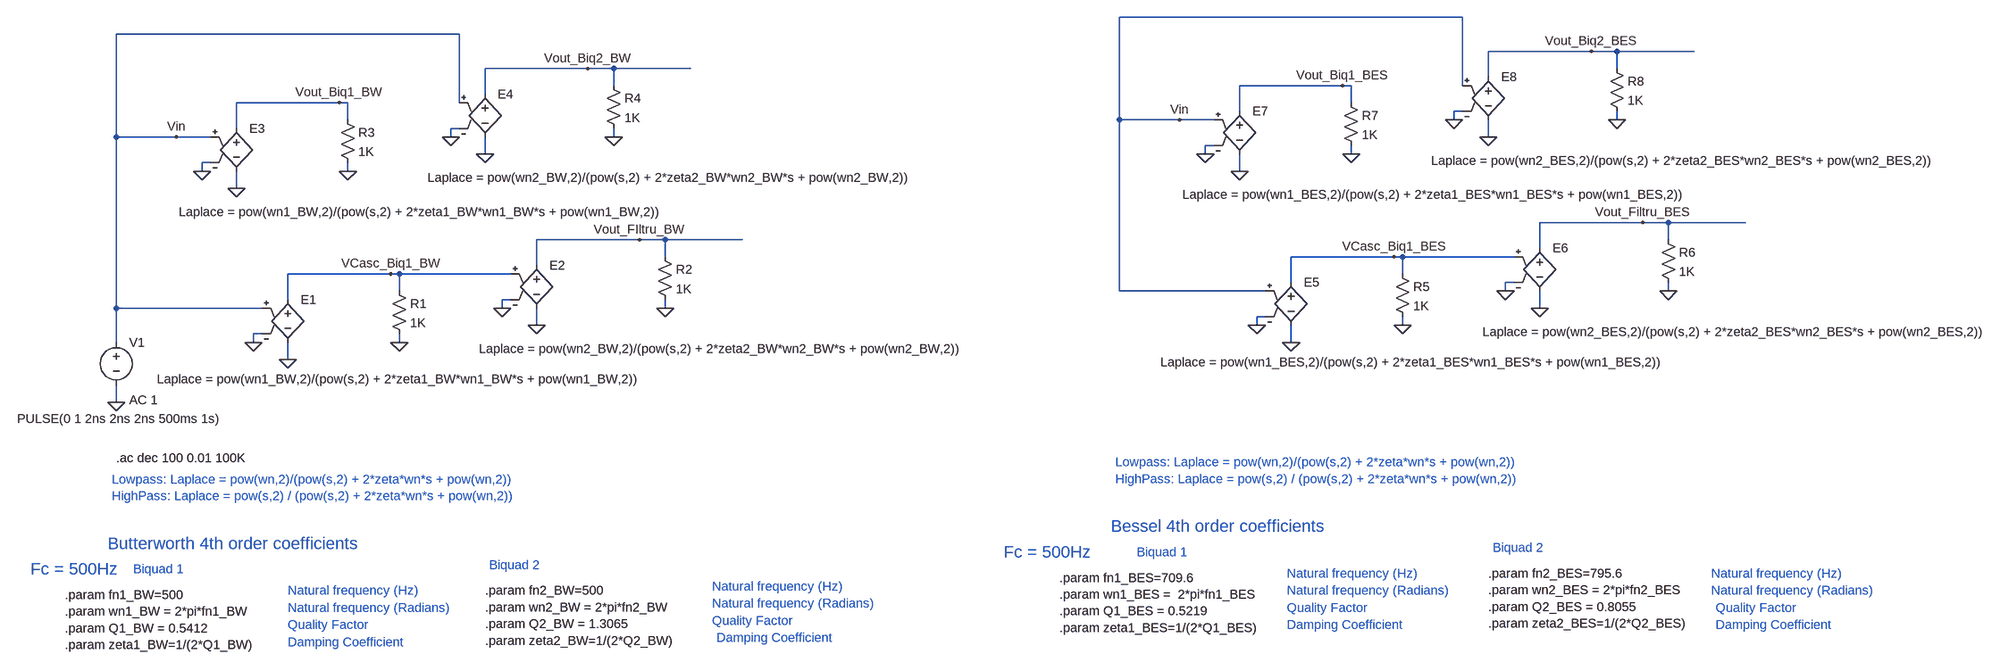
[diagram p0: schematic Laplace_Biquad_TJ_Comp_Bessel_025_Ariana.asc]
Laplace_Biquad_TJ_Comp_Bessel_025_Ariana.asc, the LTspice schematic file:
Version 4.1
SHEET 1 3528 812
WIRE 2464 -496 1824 -496
WIRE 592 -464 -48 -464
WIRE 2704 -432 2512 -432
WIRE 2752 -432 2704 -432
WIRE 2896 -432 2752 -432
WIRE 832 -400 640 -400
WIRE 880 -400 832 -400
WIRE 1024 -400 880 -400
WIRE 2752 -400 2752 -432
WIRE 2512 -384 2512 -432
WIRE 880 -368 880 -400
WIRE 2240 -368 2048 -368
WIRE 2256 -368 2240 -368
WIRE 2464 -368 2464 -496
WIRE 640 -352 640 -400
WIRE 368 -336 176 -336
WIRE 384 -336 368 -336
WIRE 592 -336 592 -464
WIRE 2256 -336 2256 -368
WIRE 2048 -320 2048 -368
WIRE 2464 -320 2448 -320
WIRE 384 -304 384 -336
WIRE 1824 -304 1824 -496
WIRE 1936 -304 1824 -304
WIRE 2000 -304 1936 -304
WIRE 2448 -304 2448 -320
WIRE 2752 -304 2752 -320
WIRE 176 -288 176 -336
WIRE 592 -288 576 -288
WIRE -48 -272 -48 -464
WIRE 64 -272 -48 -272
WIRE 128 -272 64 -272
WIRE 576 -272 576 -288
WIRE 880 -272 880 -288
WIRE 2512 -272 2512 -304
WIRE 2000 -256 1984 -256
WIRE 640 -240 640 -272
WIRE 1984 -240 1984 -256
WIRE 2256 -240 2256 -256
WIRE 128 -224 112 -224
WIRE 112 -208 112 -224
WIRE 384 -208 384 -224
WIRE 2048 -208 2048 -240
WIRE 176 -176 176 -208
WIRE 2800 -112 2608 -112
WIRE 2848 -112 2800 -112
WIRE 2992 -112 2848 -112
WIRE 928 -80 736 -80
WIRE 976 -80 928 -80
WIRE 1120 -80 976 -80
WIRE 2848 -80 2848 -112
WIRE 2608 -64 2608 -112
WIRE 976 -48 976 -80
WIRE 2336 -48 2144 -48
WIRE 2352 -48 2336 -48
WIRE 2560 -48 2352 -48
WIRE 736 -32 736 -80
WIRE 464 -16 272 -16
WIRE 480 -16 464 -16
WIRE 688 -16 480 -16
WIRE 2352 -16 2352 -48
WIRE 2144 0 2144 -48
WIRE 2560 0 2544 0
WIRE 480 16 480 -16
WIRE 1824 16 1824 -304
WIRE 2096 16 1824 16
WIRE 2544 16 2544 0
WIRE 2848 16 2848 0
WIRE 272 32 272 -16
WIRE 688 32 672 32
WIRE -48 48 -48 -272
WIRE 224 48 -48 48
WIRE 672 48 672 32
WIRE 976 48 976 32
WIRE 2608 48 2608 16
WIRE 2096 64 2080 64
WIRE 736 80 736 48
WIRE 2080 80 2080 64
WIRE 2352 80 2352 64
WIRE 224 96 208 96
WIRE -48 112 -48 48
WIRE 208 112 208 96
WIRE 480 112 480 96
WIRE 2144 112 2144 80
WIRE 272 144 272 112
WIRE -48 224 -48 192
FLAG -48 224 0
FLAG 208 112 0
FLAG 272 144 0
FLAG 464 -16 VCasc_Biq1_BW
FLAG 672 48 0
FLAG 736 80 0
FLAG 928 -80 Vout_FIltru_BW
FLAG 480 112 0
FLAG 976 48 0
FLAG 64 -272 Vin
FLAG 112 -208 0
FLAG 176 -176 0
FLAG 368 -336 Vout_Biq1_BW
FLAG 576 -272 0
FLAG 640 -240 0
FLAG 832 -400 Vout_Biq2_BW
FLAG 384 -208 0
FLAG 880 -272 0
FLAG 2080 80 0
FLAG 2144 112 0
FLAG 2336 -48 VCasc_Biq1_BES
FLAG 2544 16 0
FLAG 2608 48 0
FLAG 2800 -112 Vout_Filtru_BES
FLAG 2352 80 0
FLAG 2848 16 0
FLAG 1936 -304 Vin
FLAG 1984 -240 0
FLAG 2048 -208 0
FLAG 2240 -368 Vout_Biq1_BES
FLAG 2448 -304 0
FLAG 2512 -272 0
FLAG 2704 -432 Vout_Biq2_BES
FLAG 2256 -240 0
FLAG 2752 -304 0
SYMBOL voltage -48 96 R0
WINDOW 123 24 124 Left 2
WINDOW 39 0 0 Left 2
WINDOW 3 -185 159 Left 2
SYMATTR Value2 AC 1
SYMATTR Value PULSE(0 1 2ns 2ns 2ns 500ms 1s)
SYMATTR InstName V1
SYMBOL e 272 16 R0
WINDOW 3 -244 165 Left 2
SYMATTR Value Laplace = pow(wn1_BW,2)/(pow(s,2) + 2*zeta1_BW*wn1_BW*s + pow(wn1_BW,2))
SYMATTR InstName E1
SYMBOL e 736 -48 R0
WINDOW 3 -107 172 Left 2
SYMATTR Value Laplace = pow(wn2_BW,2)/(pow(s,2) + 2*zeta2_BW*wn2_BW*s + pow(wn2_BW,2))
SYMATTR InstName E2
SYMBOL res 464 0 R0
SYMATTR InstName R1
SYMATTR Value 1K
SYMBOL res 960 -64 R0
SYMATTR InstName R2
SYMATTR Value 1K
SYMBOL e 176 -304 R0
WINDOW 3 -107 172 Left 2
SYMATTR Value Laplace = pow(wn1_BW,2)/(pow(s,2) + 2*zeta1_BW*wn1_BW*s + pow(wn1_BW,2))
SYMATTR InstName E3
SYMBOL e 640 -368 R0
WINDOW 3 -107 172 Left 2
SYMATTR Value Laplace = pow(wn2_BW,2)/(pow(s,2) + 2*zeta2_BW*wn2_BW*s + pow(wn2_BW,2))
SYMATTR InstName E4
SYMBOL res 368 -320 R0
SYMATTR InstName R3
SYMATTR Value 1K
SYMBOL res 864 -384 R0
SYMATTR InstName R4
SYMATTR Value 1K
SYMBOL e 2144 -16 R0
WINDOW 3 -244 165 Left 2
SYMATTR Value Laplace = pow(wn1_BES,2)/(pow(s,2) + 2*zeta1_BES*wn1_BES*s + pow(wn1_BES,2))
SYMATTR InstName E5
SYMBOL e 2608 -80 R0
WINDOW 3 -107 172 Left 2
SYMATTR Value Laplace = pow(wn2_BES,2)/(pow(s,2) + 2*zeta2_BES*wn2_BES*s + pow(wn2_BES,2))
SYMATTR InstName E6
SYMBOL res 2336 -32 R0
SYMATTR InstName R5
SYMATTR Value 1K
SYMBOL res 2832 -96 R0
SYMATTR InstName R6
SYMATTR Value 1K
SYMBOL e 2048 -336 R0
WINDOW 3 -107 172 Left 2
SYMATTR Value Laplace = pow(wn1_BES,2)/(pow(s,2) + 2*zeta1_BES*wn1_BES*s + pow(wn1_BES,2))
SYMATTR InstName E7
SYMBOL e 2512 -400 R0
WINDOW 3 -107 172 Left 2
SYMATTR Value Laplace = pow(wn2_BES,2)/(pow(s,2) + 2*zeta2_BES*wn2_BES*s + pow(wn2_BES,2))
SYMATTR InstName E8
SYMBOL res 2240 -352 R0
SYMATTR InstName R7
SYMATTR Value 1K
SYMBOL res 2736 -416 R0
SYMATTR InstName R8
SYMATTR Value 1K
TEXT -144 584 Left 2 !.param fn1_BW=500\n.param wn1_BW = 2*pi*fn1_BW\n.param Q1_BW = 0.5412\n.param zeta1_BW=1/(2*Q1_BW)
TEXT -48 328 Left 2 !.ac dec 100 0.01 100K
TEXT 272 576 Left 2 ;Natural frequency (Hz)
TEXT 272 608 Left 2 ;Natural frequency (Radians)
TEXT 272 672 Left 2 ;Damping Coefficient
TEXT -16 536 Left 2 ;Biquad 1
TEXT -56 368 Left 2 ;Lowpass: Laplace = pow(wn,2)/(pow(s,2) + 2*zeta*wn*s + pow(wn,2))\nHighPass: Laplace = pow(s,2) / (pow(s,2) + 2*zeta*wn*s + pow(wn,2))
TEXT 640 576 Left 2 !.param fn2_BW=500\n.param wn2_BW = 2*pi*fn2_BW\n.param Q2_BW = 1.3065\n.param zeta2_BW=1/(2*Q2_BW)
TEXT 1064 568 Left 2 ;Natural frequency (Hz)
TEXT 1064 600 Left 2 ;Natural frequency (Radians)
TEXT 1072 664 Left 2 ;Damping Coefficient
TEXT 272 640 Left 2 ;Quality Factor
TEXT 1064 632 Left 2 ;Quality Factor
TEXT -64 488 Left 3 ;Butterworth 4th order coefficients
TEXT 648 528 Left 2 ;Biquad 2
TEXT 1712 552 Left 2 !.param fn1_BES=709.6\n.param wn1_BES =  2*pi*fn1_BES\n.param Q1_BES = 0.5219\n.param zeta1_BES=1/(2*Q1_BES)
TEXT 2136 544 Left 2 ;Natural frequency (Hz)
TEXT 2136 576 Left 2 ;Natural frequency (Radians)
TEXT 2136 640 Left 2 ;Damping Coefficient
TEXT 1856 504 Left 2 ;Biquad 1
TEXT 1816 336 Left 2 ;Lowpass: Laplace = pow(wn,2)/(pow(s,2) + 2*zeta*wn*s + pow(wn,2))\nHighPass: Laplace = pow(s,2) / (pow(s,2) + 2*zeta*wn*s + pow(wn,2))
TEXT 2512 544 Left 2 !.param fn2_BES=795.6\n.param wn2_BES = 2*pi*fn2_BES\n.param Q2_BES = 0.8055\n.param zeta2_BES=1/(2*Q2_BES)
TEXT 2928 544 Left 2 ;Natural frequency (Hz)
TEXT 2928 576 Left 2 ;Natural frequency (Radians)
TEXT 2936 640 Left 2 ;Damping Coefficient
TEXT 2136 608 Left 2 ;Quality Factor
TEXT 2936 608 Left 2 ;Quality Factor
TEXT 1808 456 Left 3 ;Bessel 4th order coefficients
TEXT 2520 496 Left 2 ;Biquad 2
TEXT 1608 504 Left 3 ;Fc = 500Hz
TEXT -208 536 Left 3 ;Fc = 500Hz

The netlist it stands for:
* Laplace_Biquad_TJ_Comp_Bessel_025_Ariana.asc
V1 Vin 0 PULSE(0 1 2ns 2ns 2ns 500ms 1s) AC 1
E1 VCasc_Biq1_BW 0 Vin 0 Laplace = pow(wn1_BW,2)/(pow(s,2) + 2*zeta1_BW*wn1_BW*s + pow(wn1_BW,2))
E2 Vout_FIltru_BW 0 VCasc_Biq1_BW 0 Laplace = pow(wn2_BW,2)/(pow(s,2) + 2*zeta2_BW*wn2_BW*s + pow(wn2_BW,2))
R1 VCasc_Biq1_BW 0 1K
R2 Vout_FIltru_BW 0 1K
E3 Vout_Biq1_BW 0 Vin 0 Laplace = pow(wn1_BW,2)/(pow(s,2) + 2*zeta1_BW*wn1_BW*s + pow(wn1_BW,2))
E4 Vout_Biq2_BW 0 Vin 0 Laplace = pow(wn2_BW,2)/(pow(s,2) + 2*zeta2_BW*wn2_BW*s + pow(wn2_BW,2))
R3 Vout_Biq1_BW 0 1K
R4 Vout_Biq2_BW 0 1K
E5 VCasc_Biq1_BES 0 Vin 0 Laplace = pow(wn1_BES,2)/(pow(s,2) + 2*zeta1_BES*wn1_BES*s + pow(wn1_BES,2))
E6 Vout_Filtru_BES 0 VCasc_Biq1_BES 0 Laplace = pow(wn2_BES,2)/(pow(s,2) + 2*zeta2_BES*wn2_BES*s + pow(wn2_BES,2))
R5 VCasc_Biq1_BES 0 1K
R6 Vout_Filtru_BES 0 1K
E7 Vout_Biq1_BES 0 Vin 0 Laplace = pow(wn1_BES,2)/(pow(s,2) + 2*zeta1_BES*wn1_BES*s + pow(wn1_BES,2))
E8 Vout_Biq2_BES 0 Vin 0 Laplace = pow(wn2_BES,2)/(pow(s,2) + 2*zeta2_BES*wn2_BES*s + pow(wn2_BES,2))
R7 Vout_Biq1_BES 0 1K
R8 Vout_Biq2_BES 0 1K
.param fn1_BW=500
.param wn1_BW = 2*pi*fn1_BW
.param Q1_BW = 0.5412
.param zeta1_BW=1/(2*Q1_BW)
.ac dec 100 0.01 100K
* Natural frequency (Hz)
* Natural frequency (Radians)
* Damping Coefficient
* Biquad 1
* Lowpass: Laplace = pow(wn,2)/(pow(s,2) + 2*zeta*wn*s + pow(wn,2))
* HighPass: Laplace = pow(s,2) / (pow(s,2) + 2*zeta*wn*s + pow(wn,2))
.param fn2_BW=500
.param wn2_BW = 2*pi*fn2_BW
.param Q2_BW = 1.3065
.param zeta2_BW=1/(2*Q2_BW)
* Natural frequency (Hz)
* Natural frequency (Radians)
* Damping Coefficient
* Quality Factor
* Quality Factor
* Butterworth 4th order coefficients
* Biquad 2
.param fn1_BES=709.6
.param wn1_BES =  2*pi*fn1_BES
.param Q1_BES = 0.5219
.param zeta1_BES=1/(2*Q1_BES)
* Natural frequency (Hz)
* Natural frequency (Radians)
* Damping Coefficient
* Biquad 1
* Lowpass: Laplace = pow(wn,2)/(pow(s,2) + 2*zeta*wn*s + pow(wn,2))
* HighPass: Laplace = pow(s,2) / (pow(s,2) + 2*zeta*wn*s + pow(wn,2))
.param fn2_BES=795.6
.param wn2_BES = 2*pi*fn2_BES
.param Q2_BES = 0.8055
.param zeta2_BES=1/(2*Q2_BES)
* Natural frequency (Hz)
* Natural frequency (Radians)
* Damping Coefficient
* Quality Factor
* Quality Factor
* Bessel 4th order coefficients
* Biquad 2
* Fc = 500Hz
* Fc = 500Hz
.backanno
.end